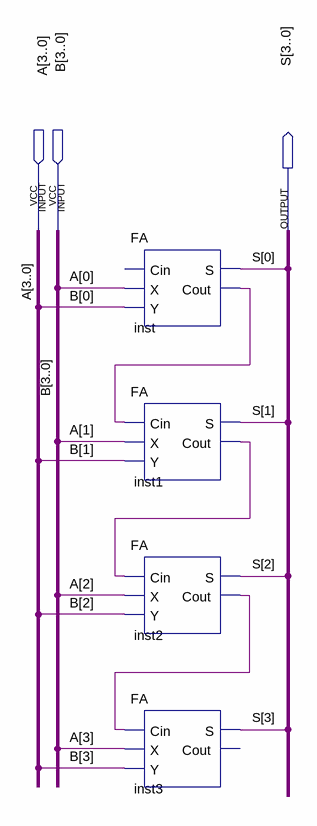
[diagram p0: schematic sheet]
// Quartus schematic FA4.bdf as structural Verilog: 4 symbols, 3 pins
module FA4 (
  input  [3:0] A,
  input  [3:0] B,
  output [3:0] S
);

  wire inst1_cout, inst2_cout, inst_cout;

  FA inst (.X(A[0]), .Y(B[0]), .S(S[0]), .Cout(inst_cout));  // open: Cin
  FA inst1 (.Cin(inst_cout), .X(A[1]), .Y(B[1]), .S(S[1]), .Cout(inst1_cout));
  FA inst2 (.Cin(inst1_cout), .X(A[2]), .Y(B[2]), .S(S[2]), .Cout(inst2_cout));
  FA inst3 (.Cin(inst2_cout), .X(A[3]), .Y(B[3]), .S(S[3]));  // open: Cout
endmodule
